# Altium project ATT-Light-v2.PrjPcb
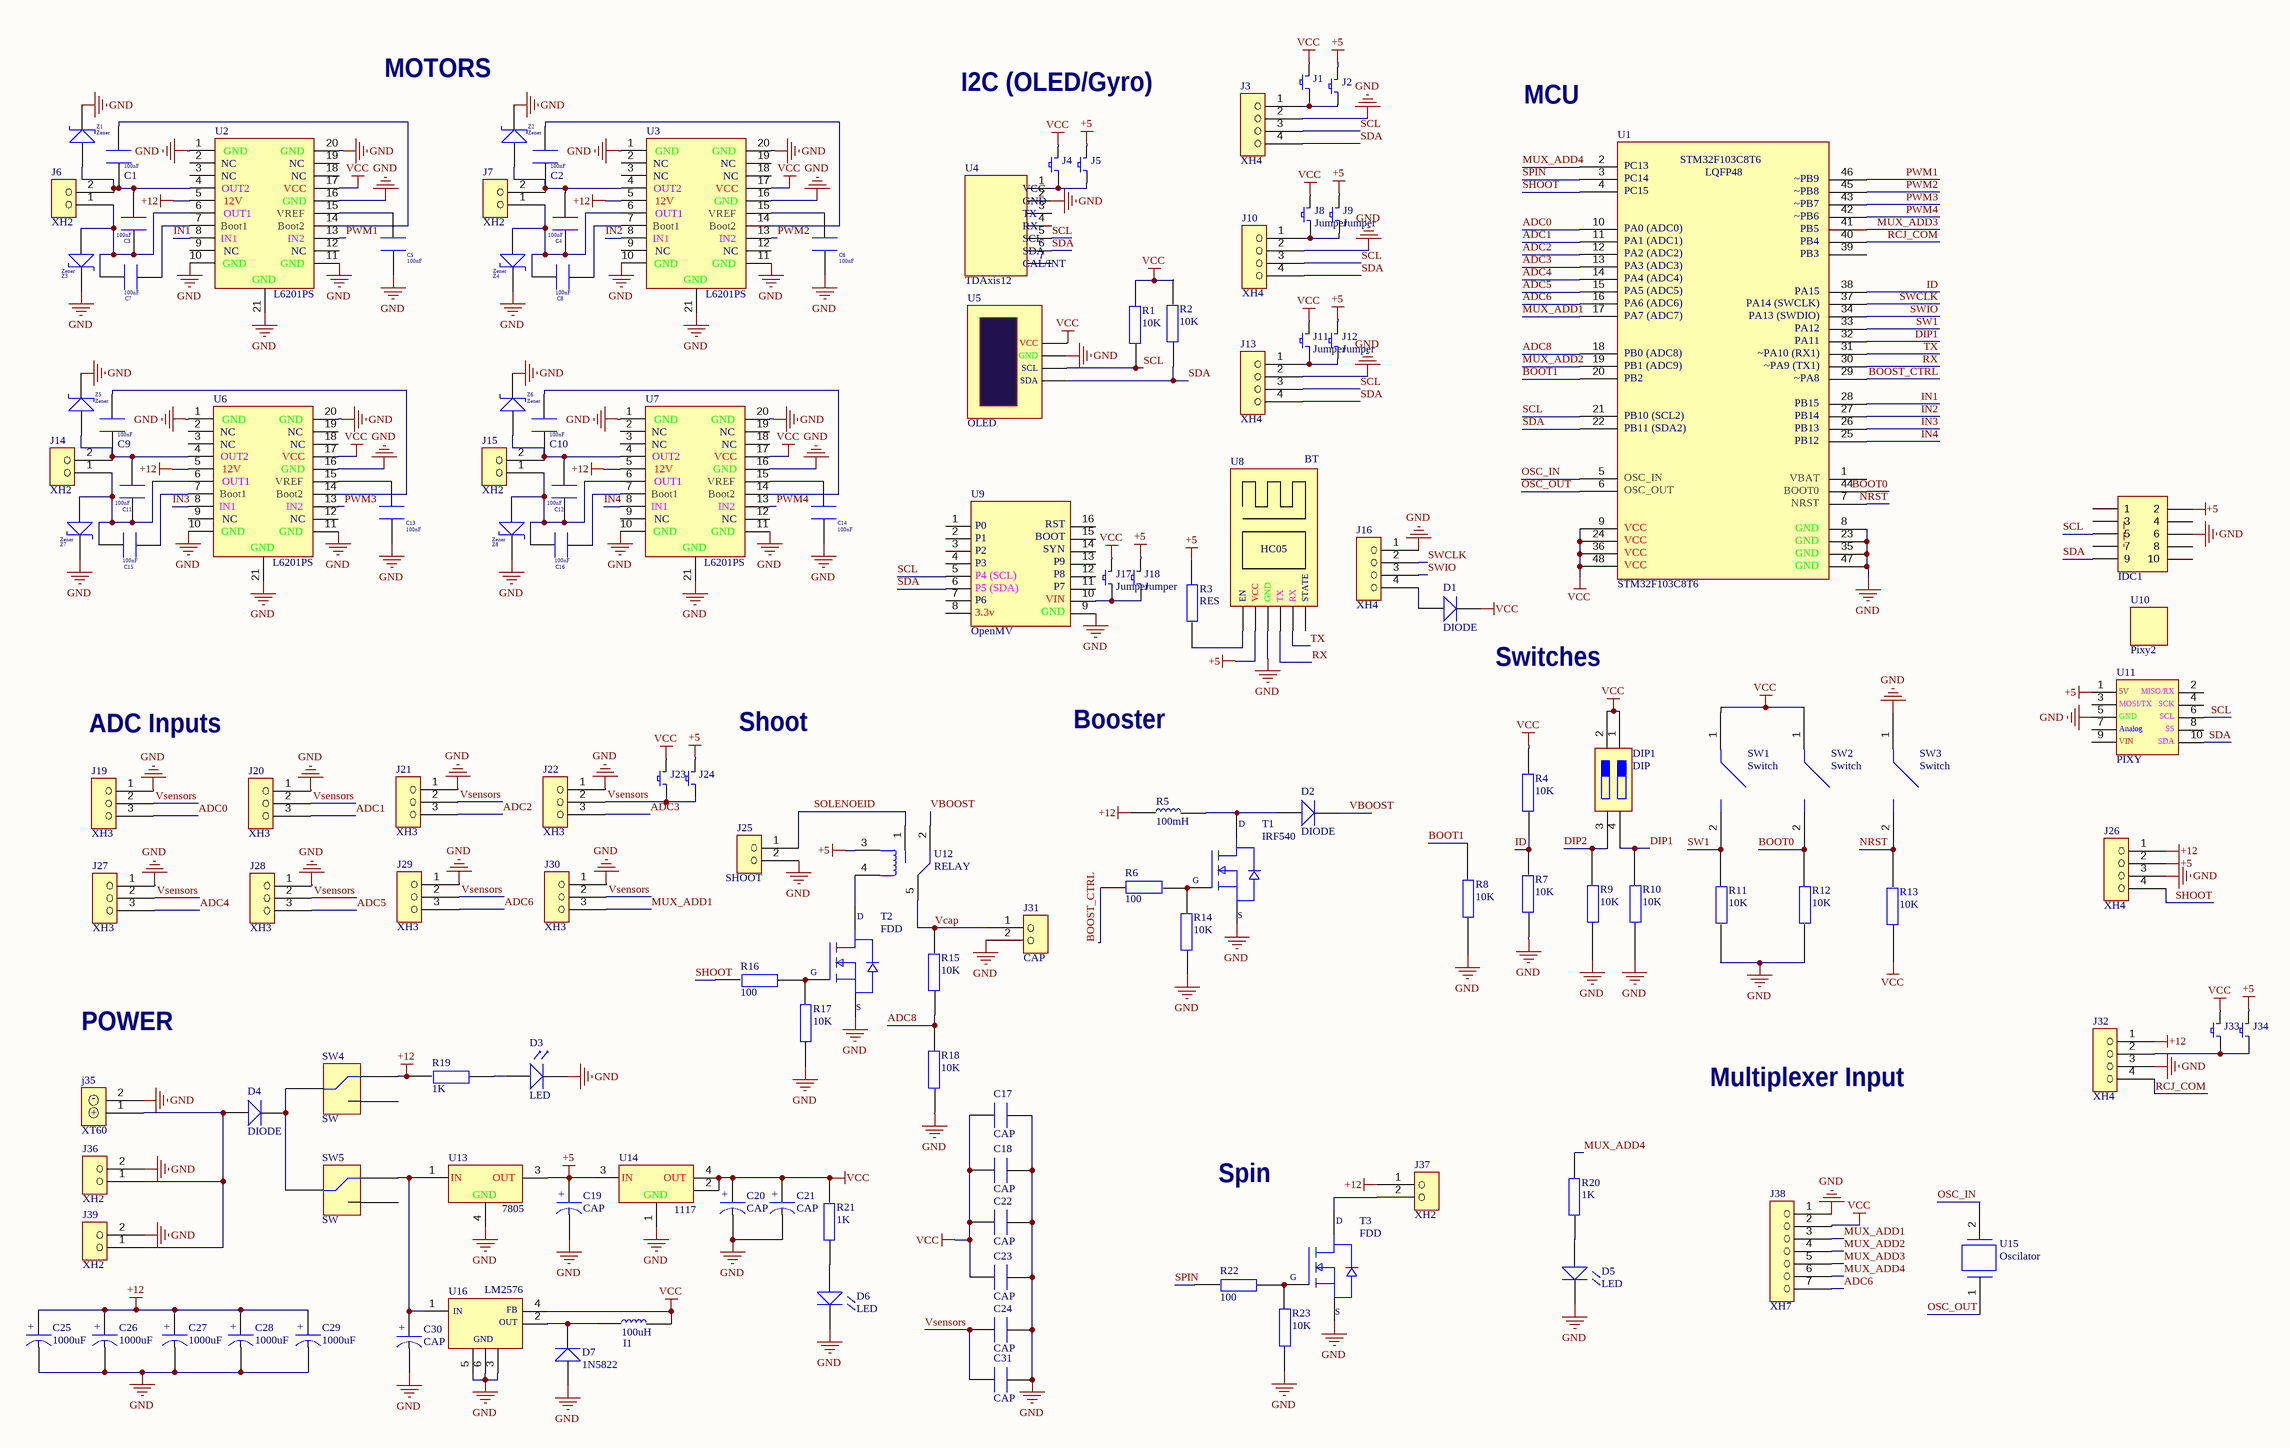
[diagram p0: ATT-Light-v2.SchDoc]
1 sheet, 135 parts. Net scope: global (net labels, ports and power ports of the same name join across sheets).
Board file: ATT-Light-v2.PcbDoc

## Sheet ATT-Light-v2.SchDoc
size 594 x 420 mm; SheetNumber: 1; SheetTotal: 1

### Parts
C1  100nF  [CAP1206]
C2  100nF  [CAP1206]
C3  100nF  [CAP1206]
C4  100nF  [CAP1206]
C5  100nF  [CAP1206]
C6  100nF  [CAP1206]
C7  100nF  [CAP1206]
C8  100nF  [CAP1206]
C9  100nF  [CAP1206]
C10  100nF  [CAP1206]
C11  100nF  [CAP1206]
C12  100nF  [CAP1206]
C13  100nF  [CAP1206]
C14  100nF  [CAP1206]
C15  100nF  [CAP1206]
C16  100nF  [CAP1206]
C17  CAP  [CAP1206]
C18  CAP  [CAP1206]
C19  CAP  [CAP SMD 100uF 16V]
C20  CAP  [CAP SMD 100uF 16V]
C21  CAP  [CAP SMD 100uF 16V]
C22  CAP  [CAP1206]
C23  CAP  [CAP1206]
C24  CAP  [CAP1206]
C25  1000uF  [CAP 5x10x13 black]
C26  1000uF  [CAP 5x10x13 black]
C27  1000uF  [CAP 5x10x13 black]
C28  1000uF  [CAP 5x10x13 black]
C29  1000uF  [CAP 5x10x13 black]
C30  CAP  [CAP SMD 100uF 16V]
C31  CAP  [CAP1206]
D1  DIODE  [Diode]
D2  DIODE  [Diode]
D3  LED  [LED GREEN 1206]
D4  DIODE  [Diode]
D5  LED  [LED GREEN 1206]
D6  LED  [LED GREEN 1206]
D7  1N5822  [1N5822]
DIP1  DIP  [DIP Switch 2]
I1  100uH  [INDUCTOR SMD 1210]
IDC1  CONNECTOR_IDC_5X2  [IDC2.54-10PIN]  (value not drawn)
J1  (no value)  [Jumper]
J2  (no value)  [Jumper]
J3  XH4  [XH 4PIN]
J4  (no value)  [Jumper]
J5  (no value)  [Jumper]
J6  XH2  [XH 2pin]
J7  XH2  [XH 2pin]
J8  Jumper  [Jumper]
J9  Jumper  [Jumper]
J10  XH4  [XH 4PIN]
J11  Jumper  [Jumper]
J12  Jumper  [Jumper]
J13  XH4  [XH 4PIN]
J14  XH2  [XH 2pin]
J15  XH2  [XH 2pin]
J16  XH4  [XH 4PIN]
J17  Jumper  [Jumper]
J18  Jumper  [Jumper]
J19  XH3  [XH 3PIN]
J20  XH3  [XH 3PIN]
J21  XH3  [XH 3PIN]
J22  XH3  [XH 3PIN]
J23  (no value)  [Jumper]
J24  (no value)  [Jumper]
J25  SHOOT  [XH 2pin]
J26  XH4  [XH 4PIN]
J27  XH3  [XH 3PIN]
J28  XH3  [XH 3PIN]
J29  XH3  [XH 3PIN]
J30  XH3  [XH 3PIN]
J31  CAP  [XH 2pin]
J32  XH4  [XH 4PIN]
J33  (no value)  [Jumper]
J34  (no value)  [Jumper]
j35  XT60  [XT60]
J36  XH2  [XH 2pin]
J37  XH2  [XH 2pin]
J38  XH7  [XH 7PIN]
J39  XH2  [XH 2pin]
R1  10K  [RES1206]
R2  10K  [RES1206]
R3  RES  [RES1206]
R4  10K  [RES1206]
R5  100mH  [inductor]
R6  100  [RES1206]
R7  10K  [RES1206]
R8  10K  [RES1206]
R9  10K  [RES1206]
R10  10K  [RES1206]
R11  10K  [RES1206]
R12  10K  [RES1206]
R13  10K  [RES1206]
R14  10K  [RES1206]
R15  10K  [RES1206]
R16  100  [RES1206]
R17  10K  [RES1206]
R18  10K  [RES1206]
R19  1K  [RES1206]
R20  1K  [RES1206]
R21  1K  [RES1206]
R22  100  [RES1206]
R23  10K  [RES1206]
SW1  Switch  [pushbutton]
SW2  Switch  [pushbutton]
SW3  Switch  [pushbutton]
SW4  SW  [SPDT Switch]
SW5  SW  [SPDT Switch]
T1  IRF540  [IRF540S]
T2  FDD  [FDD6690A]
T3  FDD  [FDD6690A]
U1  STM32F103C8T6  [STM32F103C8T6]
U2  L6201PS  [L6201 PowerSO20]
U3  L6201PS  [L6201 PowerSO20]
U4  TDAxis12  [TDAxis12]
U5  OLED  [OLED SH1106]
U6  L6201PS  [L6201 PowerSO20]
U7  L6201PS  [L6201 PowerSO20]
U8  BT  [HC05]
U9  OpenMV  [OpenMV]
U10  Pixy2  [Pixy2 - NoPins]
U11  PIXY  [Pixy CMUCAM5]
U12  RELAY  [Relay 5V 10A]
U13  7805  [7805 (SOT-252)]
U14  1117  [AMS1117]
U15  Oscilator  [Crystal Oscilator]
U16  LM2576  [LM2576]
Z1  Zener  [zener]
Z2  Zener  [zener]
Z3  Zener  [zener]
Z4  Zener  [zener]
Z5  Zener  [zener]
Z6  Zener  [zener]
Z7  Zener  [zener]
Z8  Zener  [zener]

### Nets
+5: C19.2 IDC1.2 J2.2 J5.2 J9.2 J12.2 J18.2 J24.2 J26.2 J34.2 R3.1 U8.2 U11.1 U12.3 U13.3 U14.3
+12: C25.2 C26.2 C27.2 C28.2 C29.2 J26.1 J32.1 J37.1 R5.1 R19.2 SW4.1 U2.5 U3.5 U6.5 U7.5
GND: C5.2 C6.2 C13.2 C14.2 C17.1 C18.1 C19.1 C20.1 C21.1 C22.1 C23.1 C24.1 C25.1 C26.1 C27.1 C28.1 C29.1 C30.1 C31.1 D3.2 D5.2 D6.2 D7.1 IDC1.6 J3.2 J10.2 J13.2 J16.1 J19.1 J20.1 J21.1 J22.1 J25.2 J26.3 J27.1 J28.1 J29.1 J30.1 J31.2 J32.3 j35.2 J36.2 J38.1 J39.2 R7.1 R8.2 R9.2 R10.2 R11.2 R12.2 R14.1 R17.2 R18.1 R23.2 SW3.1 T1.3 T2.3 T3.3 U1.8 U1.23 U1.35 U1.47 U2.1 U2.10 U2.11 U2.16 U2.20 U2.21 U3.1 U3.10 U3.11 U3.16 U3.20 U3.21 U4.2 U5.2 U6.1 U6.10 U6.11 U6.16 U6.20 U6.21 U7.1 U7.10 U7.11 U7.16 U7.20 U7.21 U8.3 U9.9 U11.5 U13.4 U14.1 U16.3 U16.5 U16.6 Z1.1 Z2.1 Z3.1 Z4.1 Z5.1 Z6.1 Z7.1 Z8.1
VCC: C17.2 C18.2 C20.2 C21.2 C22.2 C23.2 D1.2 DIP1.1 DIP1.2 I1.2 J1.2 J4.2 J8.2 J11.2 J17.2 J23.2 J33.2 J38.2 R1.2 R2.2 R4.2 R13.1 R21.2 SW1.1 SW2.1 U1.9 U1.24 U1.36 U1.48 U2.17 U3.17 U5.1 U6.17 U7.17 U14.2 U14.4 U16.4
ADC0: J19.3 U1.10
ADC1: J20.3 U1.11
ADC2: J21.3 U1.12
ADC3: J22.3 U1.13
ADC4: J27.3 U1.14
ADC5: J28.3 U1.15
ADC6: J29.3 J38.7 U1.16
ADC8: R15.1 R18.2 U1.18
BOOST_CTRL: R6.1 U1.29
BOOT0: R12.1 SW2.2 U1.44
BOOT1: R8.1 U1.20
DIP1: DIP1.4 R10.1 U1.32
DIP2: DIP1.3 R9.1
ID: R4.1 R7.2 U1.38
IN1: U1.28 U2.8
IN2: U1.27 U3.8
IN3: U1.26 U6.8
IN4: U1.25 U7.8
MUX_ADD1: J30.3 J38.3 U1.17
MUX_ADD2: J38.4 U1.19
MUX_ADD3: J38.5 U1.41
MUX_ADD4: J38.6 R20.2 U1.2
NRST: R13.2 SW3.2 U1.7
OSC_IN: U1.5 U15.2
OSC_OUT: U1.6 U15.1
PWM1: U1.46 U2.13
PWM2: U1.45 U3.13
PWM3: U1.43 U6.13
PWM4: U1.42 U7.13
RCJ_COM: J32.4 U1.40
RX: U1.30 U8.4
SCL: IDC1.5 J3.3 J10.3 J13.3 R1.1 U1.21 U4.5 U5.3 U9.5 U11.6
SDA: IDC1.9 J3.4 J10.4 J13.4 R2.1 U1.22 U4.6 U5.4 U9.6 U11.10
SHOOT: J26.4 R16.2 U1.4
SOLENOEID: J25.1 U12.1
SPIN: R22.2 U1.3
SW1: R11.1 SW1.2 U1.33
SWCLK: J16.2 U1.37
SWIO: J16.3 U1.34
TX: U1.31 U8.5
VBOOST: D2.2 U12.2
Vcap: J31.1 R15.2 U12.5
Vsensors: C24.2 C31.2 J19.2 J20.2 J21.2 J22.2 J23.1 J24.1 J27.2 J28.2 J29.2 J30.2
NetC1_1: C1.1 U2.14
NetC1_2: C1.2 C3.2 J6.2 U2.4 Z1.2
NetC2_1: C2.1 U3.14
NetC2_2: C2.2 C4.2 J7.2 U3.4 Z2.2
NetC3_1: C3.1 C7.2 J6.1 U2.6 Z3.2
NetC4_1: C4.1 C8.2 J7.1 U3.6 Z4.2
NetC5_1: C5.1 U2.15
NetC6_1: C6.1 U3.15
NetC7_1: C7.1 U2.7
NetC8_1: C8.1 U3.7
NetC9_1: C9.1 U6.14
NetC9_2: C9.2 C11.2 J14.2 U6.4 Z5.2
NetC10_1: C10.1 U7.14
NetC10_2: C10.2 C12.2 J15.2 U7.4 Z6.2
NetC11_1: C11.1 C15.2 J14.1 U6.6 Z7.2
NetC12_1: C12.1 C16.2 J15.1 U7.6 Z8.2
NetC13_1: C13.1 U6.15
NetC14_1: C14.1 U7.15
NetC15_1: C15.1 U6.7
NetC16_1: C16.1 U7.7
NetC30_2: C30.2 SW5.1 U13.1 U16.1
NetD1_1: D1.1 J16.4
NetD2_1: D2.1 R5.2 T1.4
NetD3_1: D3.1 R19.1
NetD4_1: D4.1 j35.1 J36.1 J39.1
NetD4_2: D4.2 SW4.2 SW5.2
NetD5_1: D5.1 R20.1
NetD6_1: D6.1 R21.1
NetD7_2: D7.2 I1.1 U16.2
NetJ1_1: J1.1 J2.1 J3.1
NetJ4_1: J4.1 J5.1 U4.1
NetJ8_1: J8.1 J9.1 J10.1
NetJ11_1: J11.1 J12.1 J13.1
NetJ17_1: J17.1 J18.1 U9.10
NetJ32_2: J32.2 J33.1 J34.1
NetJ37_2: J37.2 T3.4
NetR3_2: R3.2 U8.1
NetR6_2: R6.2 R14.2 T1.1
NetR16_1: R16.1 R17.1 T2.1
NetR22_1: R22.1 R23.1 T3.1
NetT2_4: T2.4 U12.4

Not connected (* = marked no-connect by the designer): IDC1 1 3 4 7 8 10; SW4 3; SW5 3; U1 1 39; U2 2 3 9 12 18 19; U3 2 3 9 12 18 19; U4 3 4 7; U6 2 3 9 12 18 19; U7 2 3 9 12 18 19; U8 6; U9 1 2 3 4 7 8 11 12 13 14 15 16; U11 2 3 4 7 8 9

### Notes on the sheet
- MOTORS
- I2C (OLED/Gyro)
- MCU
- Switches
- ADC Inputs
- Shoot
- Booster
- POWER
- Multiplexer Input
- Spin
- DWG NO:
- REV:
- THIS DOCUMENT AND THE DATA DISCLOSED HEREIN OR
- HEREWITH IS THE PROPERTY OF ALTIUM LIMITED AND MAY
- BE FREELY DISTRIBUTED IN WHOLE. NO RIGHTS ARE
- RESERVED OR EXPRESS OR IMPLIED WARANTEE GIVEN.
- REVISION
- DESCRIPTION
- DATE
- APPROVED
- ENG:
- APPROVALS
- PROJECT
- DSN:
- CHK:
- REFERENCE DOCUMENTS
- PROJECT REVISION:
- TITLE
- DOCUMENT REVISION:
- DESIGN ITEM:
- BOM:
- FAB DWG:
- PCB DWG:
- ASSY DWG:
- SCALE:
- A2
- SIZE
- CAGE CODE
- FILE NAME
- DWG NO.
- SHEET
- OF
- REV
- (in symbol 7805 (SOT-252)) IN; OUT; GND
- (in symbol AMS1117) IN; OUT; GND
- (in symbol CAP Electrolit SMD) +
- (in symbol Cap Electrolyte) +
- (in symbol FDD6690A) D; G; S
- (in symbol HC05) EN; VCC; GND; TX; RX; STATE
- (in symbol IRF540S) D; G; S
- (in symbol L6201 PowerSO20) GND; NC; OUT2; VCC; 12V; OUT1; VREF; Boot1; Boot2; IN1; IN2
- (in symbol LM2576) FB; IN; OUT; GND
- (in symbol OLED SH1106) VCC; GND; SCL; SDA
- (in symbol OpenMV) RST; P0; BOOT; P1; SYN; P2; P9; P3; P8; P4 (SCL); P7; P5 (SDA); VIN; P6; GND; 3.3v
- (in symbol Pixy CMUCAM 5) 5V; MISO/RX; MOSI/TX; SCK; GND; SCL; Analog; SS; VIN; SDA
- (in symbol STM32F103C8T6) PC13; LQFP48; ~PB9; PC14; ~PB8; PC15; ~PB7; ~PB6; PB5; PA0 (ADC0); PB4; PA1 (ADC1); PB3; PA2 (ADC2); PA3 (ADC3); PA4 (ADC4); PA15; PA5 (ADC5); PA14 (SWCLK); PA6 (ADC6); PA13 (SWDIO); PA7 (ADC7); PA12; PA11; ~PA10 (RX1); PB0 (ADC8); ~PA9 (TX1); PB1 (ADC9); ~PA8; PB2; PB15; PB14; PB10 (SCL2); PB13; PB11 (SDA2); PB12; VBAT; OSC_IN; BOOT0; OSC_OUT; NRST; GND; VCC
- (in symbol TDAxis12) VCC; GND; TX; RX; SCL; SDA; CAL/INT
- (in symbol XT60) -; +

### Library data of the parts
C1-C18 C22-C24 C31 = CAP1206: Capacitor SMD 1206
C19-C21 C30 = CAP Electrolit SMD: Capacitor Electrolit SMD
C25-C29 = Cap Electrolyte: CAP DIP
D3 D5 D6 = LED SMD 1206
D7 = 1N5822: 1N5822 DIODE
DIP1 = DIP SW 2: DIP Switch 2 pin
I1 = INDUCTOR SMD 1210
IDC1 = IDC 5X2: IDC, 5-Pin, Dual row; Manufacturer: CHINA; designer: ABBAS BASEREH; Connector type: IDC5X2  PROGPIN; Max Current: mA; LatestRevisionDate: 1395-11-17; Publisher: ABBAS BASEREH; Mounting Technology: Through-Hole; Category: Connector; Pin Count: 10; Status: Unreleased; ComponentLink1Description: Datasheet; ComponentLink2Description: Reference; Update: 2017-2-4
J1 J2 J4 J5 J23 J24 J33 J34 = Jumper
J3 J10 J13 J16 J26 J32 = XH 4PIN: XH Connector 4pins
J6 J7 J14 J15 J25 J31 J36 J37 J39 = XH 2PIN: XH Connector 2pins
J19-J22 J27-J30 = XH 3PIN: XH Connector 3pins
j35 = XT60: XT60 Power Connector
J38 = XH 7Pin: XH Connector 7pins
R1-R4 R6-R23 = RES1206: RESISTOR SMD
R5 = inductor: SELF INDUCTOR
SW1-SW3 = pushbutton: Switch SMD Tact
SW4 SW5 = SPDT Switch: SPDT Power Switch
T1 = IRF540S: IRF-540 MOSFET N-Chanel
T2 T3 = FDD6690A: FDD6690A MOSFET N-Chanel
U1 = STM32F103C8T6: STM32F103C8T6 / LQFP48
U2 U3 U6 U7 = L6201 PowerSO20: L6201 PowerSO20 Motor Driver
U4 = TDAxis12: Gyroscpoe Sensor
U5 = OLED SH1106: OLED SH1106 1.3inch
U8 = HC05: Bluetooth HC05 Module
U9 = OpenMV: OpenMV Camera H7 R2
U10 = Pixy2 - No Pins
U11 = Pixy CMUCAM 5
U12 = Relay 5V 10A
U13 = 7805 (SOT-252): 5v Regulator
U14 = AMS1117: 3.3v Regulator
U15 = Crystal: Crystal Oscilator 8MHz
Z1-Z8 = Zener Diode